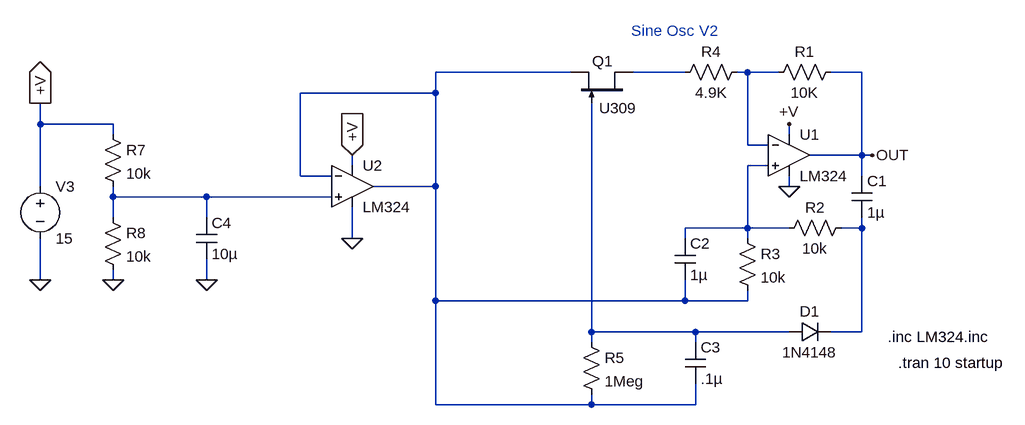
[diagram p0: schematic Sine_Osc_v2.asc]
Sine_Osc_v2.asc, the LTspice schematic file:
Version 4
SHEET 1 880 680
WIRE -480 -400 -688 -400
WIRE -304 -400 -384 -400
WIRE -208 -400 -224 -400
WIRE -160 -400 -208 -400
WIRE -32 -400 -80 -400
WIRE -688 -368 -688 -400
WIRE -688 -368 -896 -368
WIRE -1296 -320 -1296 -352
WIRE -1184 -320 -1296 -320
WIRE -1184 -304 -1184 -320
WIRE -144 -304 -144 -320
WIRE -208 -288 -208 -400
WIRE -176 -288 -208 -288
WIRE -32 -272 -32 -400
WIRE -32 -272 -112 -272
WIRE -16 -272 -32 -272
WIRE -816 -256 -816 -272
WIRE -176 -256 -208 -256
WIRE -896 -240 -896 -368
WIRE -848 -240 -896 -240
WIRE -32 -240 -32 -272
WIRE -1296 -224 -1296 -320
WIRE -688 -224 -688 -368
WIRE -688 -224 -784 -224
WIRE -144 -224 -144 -240
WIRE -1184 -208 -1184 -224
WIRE -1040 -208 -1184 -208
WIRE -848 -208 -1040 -208
WIRE -1184 -176 -1184 -208
WIRE -1040 -176 -1040 -208
WIRE -208 -160 -208 -256
WIRE -208 -160 -304 -160
WIRE -144 -160 -208 -160
WIRE -32 -160 -32 -176
WIRE -32 -160 -64 -160
WIRE -816 -144 -816 -192
WIRE -304 -144 -304 -160
WIRE -208 -144 -208 -160
WIRE -1296 -80 -1296 -144
WIRE -1184 -80 -1184 -96
WIRE -1040 -80 -1040 -112
WIRE -688 -48 -688 -224
WIRE -304 -48 -304 -80
WIRE -304 -48 -688 -48
WIRE -208 -48 -208 -64
WIRE -208 -48 -304 -48
WIRE -448 0 -448 -352
WIRE -288 0 -448 0
WIRE -144 0 -288 0
WIRE -32 0 -32 -160
WIRE -32 0 -80 0
WIRE -448 16 -448 0
WIRE -288 16 -288 0
WIRE -688 112 -688 -48
WIRE -448 112 -448 96
WIRE -448 112 -688 112
WIRE -288 112 -288 80
WIRE -288 112 -448 112
FLAG -144 -320 +V
FLAG -16 -272 OUT
FLAG -1296 -80 0
FLAG -1296 -352 +V
IOPIN -1296 -352 Out
FLAG -816 -272 +V
IOPIN -816 -272 In
FLAG -1184 -80 0
FLAG -816 -144 0
FLAG -1040 -80 0
FLAG -144 -224 0
SYMBOL res -64 -416 R90
WINDOW 0 0 56 VBottom 2
WINDOW 3 32 56 VTop 2
SYMATTR InstName R1
SYMATTR Value 10K
SYMBOL cap -48 -240 R0
SYMATTR InstName C1
SYMATTR Value 1µ
SYMBOL res -48 -176 R90
WINDOW 0 0 56 VBottom 2
WINDOW 3 32 56 VTop 2
SYMATTR InstName R2
SYMATTR Value 10k
SYMBOL cap -320 -144 R0
SYMATTR InstName C2
SYMATTR Value 1µ
SYMBOL res -224 -160 R0
SYMATTR InstName R3
SYMATTR Value 10k
SYMBOL res -208 -416 R90
WINDOW 0 0 56 VBottom 2
WINDOW 3 32 56 VTop 2
SYMATTR InstName R4
SYMATTR Value 4.9K
SYMBOL njf -384 -352 M270
WINDOW 0 49 47 VTop 2
WINDOW 3 -7 52 VLeft 2
SYMATTR InstName Q1
SYMATTR Value U309
SYMBOL diode -144 16 R270
WINDOW 0 32 32 VTop 2
WINDOW 3 0 32 VBottom 2
SYMATTR InstName D1
SYMATTR Value 1N4148
SYMBOL res -464 0 R0
SYMATTR InstName R5
SYMATTR Value 1Meg
SYMBOL cap -304 16 R0
SYMATTR InstName C3
SYMATTR Value .1µ
SYMBOL Opamps\\opamp2 -144 -336 R0
SYMATTR InstName U1
SYMATTR Value LM324
SYMATTR SpiceModel LM324
SYMBOL voltage -1296 -240 R0
WINDOW 123 0 0 Left 2
WINDOW 39 0 0 Left 2
SYMATTR InstName V3
SYMATTR Value 15
SYMBOL res -1200 -320 R0
SYMATTR InstName R7
SYMATTR Value 10k
SYMBOL res -1200 -192 R0
SYMATTR InstName R8
SYMATTR Value 10k
SYMBOL Opamps\\opamp2 -816 -288 R0
SYMATTR InstName U2
SYMATTR Value LM324
SYMATTR SpiceModel LM324
SYMBOL cap -1056 -176 R0
SYMATTR InstName C4
SYMATTR Value 10µ
TEXT -320 -448 Bottom 2 ;Sine Osc V2
TEXT 24 48 Left 2 !.tran 10 startup
TEXT 8 8 Left 2 !.inc LM324.inc

The netlist it stands for:
* Sine_Osc_v2.asc
R1 OUT N003 10K
C1 OUT N006 1µ
R2 N006 N004 10k
C2 N004 N001 1µ
R3 N004 N001 10k
R4 N003 N002 4.9K
J§Q1 N002 N007 N001 U309
D1 N007 N006 1N4148
R5 N007 N001 1Meg
C3 N007 N001 .1µ
XU1 N004 N003 +V 0 OUT LM324 LM324  ; pins In+ In- V+ V- OUT
V3 +V 0 15
R7 +V N005 10k
R8 N005 0 10k
XU2 N005 N001 +V 0 N001 LM324 LM324  ; pins In+ In- V+ V- OUT
C4 N005 0 10µ
.model D D
.lib standard.dio
.model NJF NJF
.model PJF PJF
.lib standard.jft
* Sine Osc V2
.tran 10 startup
.inc LM324.inc
.backanno
.end